# Altium schematic sheet XL4016.SchDoc
size A3
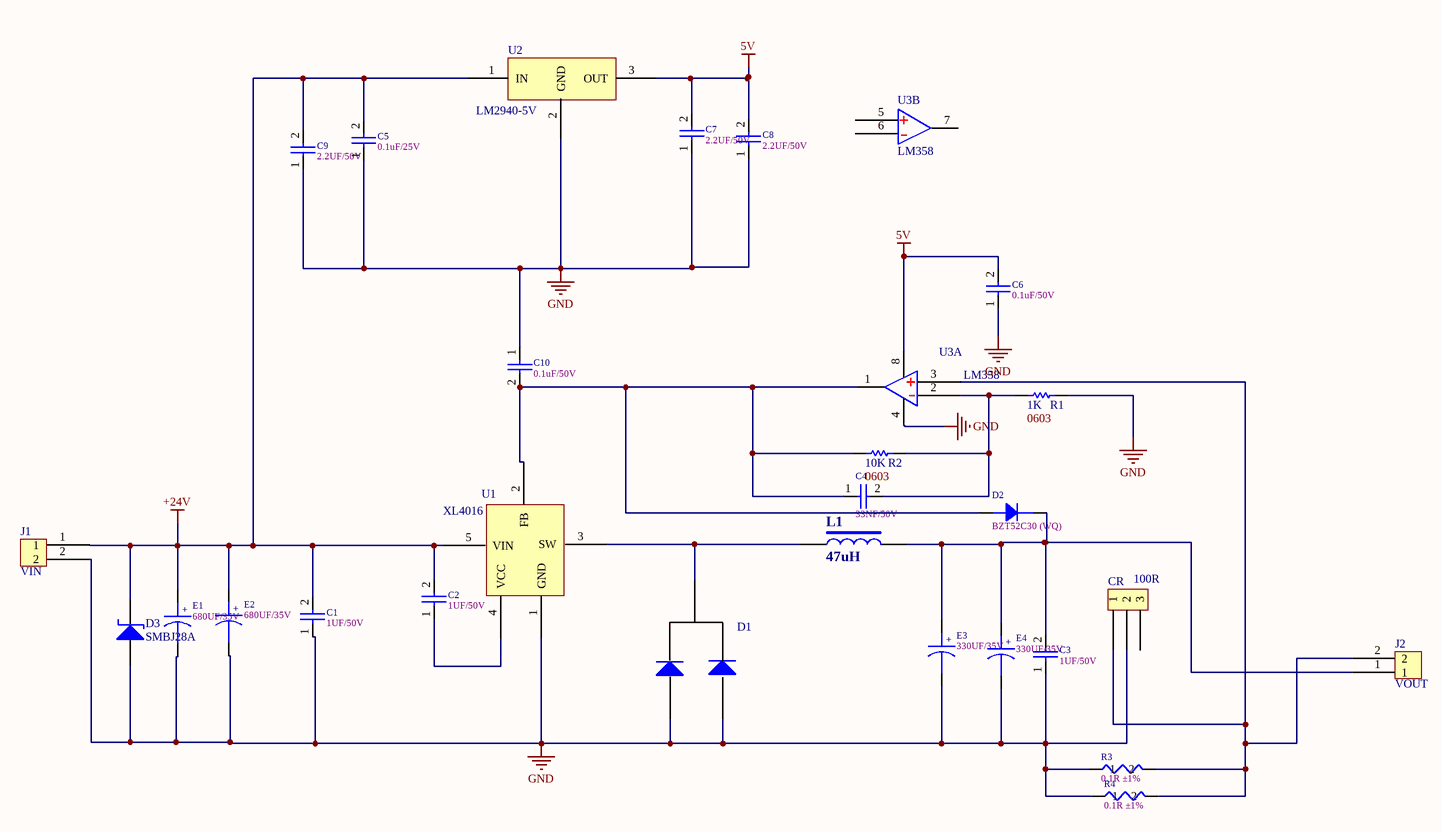
[diagram p0: XL4016.SchDoc]

## Parts
C1  1UF/50V  [C0805]
C2  1UF/50V  [C0805]
C3  1UF/50V  [C0805]
C4  33NF/50V  [C0603]
C5  0.1uF/25V  [C0603]
C6  0.1uF/50V  [C0603]
C7  2.2UF/50V  [C0805]
C8  2.2UF/50V  [C0805]
C9  2.2UF/50V  [C0805]
C10  0.1uF/50V  [C0603]
CR  100R  [3296W]
D1  Schottky  [TO-2520]  (value not drawn)
D2  BZT52C30 (WQ)  [SOD123]
D3  SMBJ28A  [DO214AA]
E1  680UF/35V  [C10X17]
E2  680UF/35V  [C10X17]
E3  330UF/35V  [C10X17]
E4  330UF/35V  [C10X17]
J1  VIN  [VH3.96_2WP]
J2  VOUT  [VH3.96_2WP]
L1  47uH  [L24x10]
R1  1K  Footprint: 0603  [0603RES]
R2  10K  Footprint: 0603  [0603RES]
R3  0.1R ±1%  [R1206]
R4  0.1R ±1%  [R1206]
U1  XL4016  [TO220-5L]
U2  LM2940-5V  [SOT-223]
U3  LM358  [SOP8L]  (parts A,B of 2)

## Nets
5V: C6.2 C7.2 C8.2 U2.3(OUT) U3.8
+24V: C1.2 C2.2 C5.2 C9.2 D3.2(K) E1.1 E2.1 J1.1 U1.5(VIN) U2.1(IN)
GND: C1.1 C3.1 C5.1 C6.1 C7.1 C8.1 C9.1 C10.1 CR.2 D1.1 D1.3 D3.1(A) E1.2 E2.2 E3.2 E4.2 J1.2 R1.2 R3.1 R4.1 U1.1(GND) U2.2(GND) U3.4
NetC2_1: C2.1 U1.4(VCC)
NetC3_2: C3.2 D2.2(K) E3.1 E4.1 J2.1 L1.2
NetC4_1: C4.1 C10.2 D2.1(A) R2.1 U1.2(FB) U3.1
NetC4_2: C4.2 R1.1 R2.2 U3.2
NetCR_1: CR.1 J2.2 R3.2 R4.2 U3.3
NetD1_2: D1.2 L1.1 U1.3(SW)

Not connected (* = marked no-connect by the designer): CR 3; U3 5 6 7

## Notes on the sheet
- (in symbol CAPACITOR POL) +

## Library data of the parts
C1-C3 C7-C9 = CAP_5: Capacitor
C4-C6 C10 = CAP: Capacitor
CR = RV
D2 = DIODE._1: Diode
D3 = TVS
E1-E4 = CAPACITOR POL: Capacitor
J1 J2 = VH3.96_2P
L1 = INDUCTOR2
R1 R2 = Res1_4: Resistor; Published: 8-Jun-2000; LatestRevisionDate: 17-Jul-2002; LatestRevisionNote: Re-released for DXP Platform.; Publisher: Altium Limited
R3 R4 = RES